# Altium schematic sheet S7CAS-PLEIADES-CARTE-MERE_P06_FPGA2.SCHDOC
size Tabloid; SheetNumber: 7; SheetTotal: 18; Sheet_Name: FPGA2; Size: 11x17
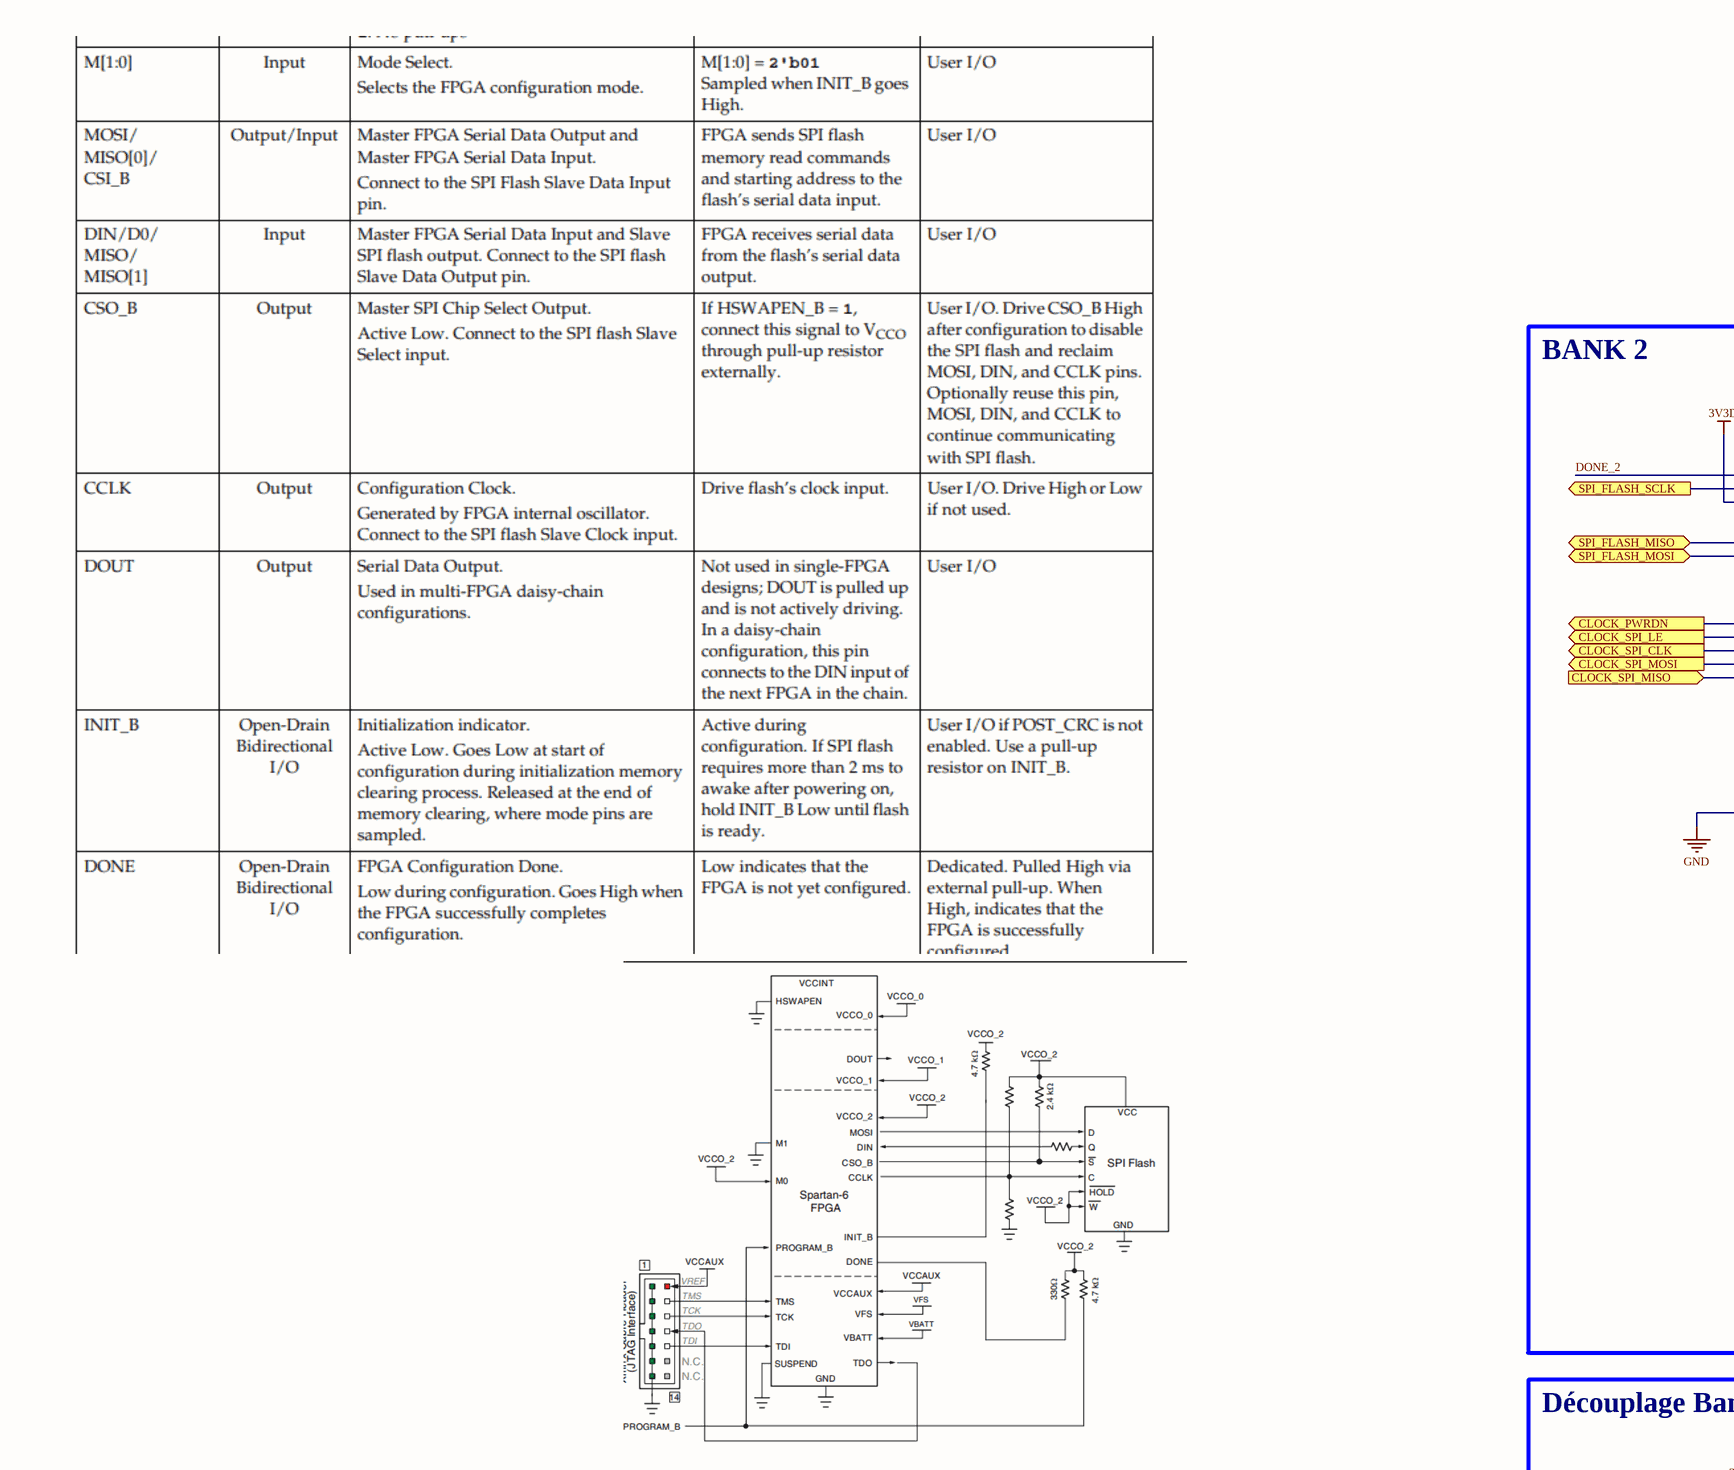
[diagram p0: S7CAS-PLEIADES-CARTE-MERE_P06_FPGA2.SCHDOC, top left]
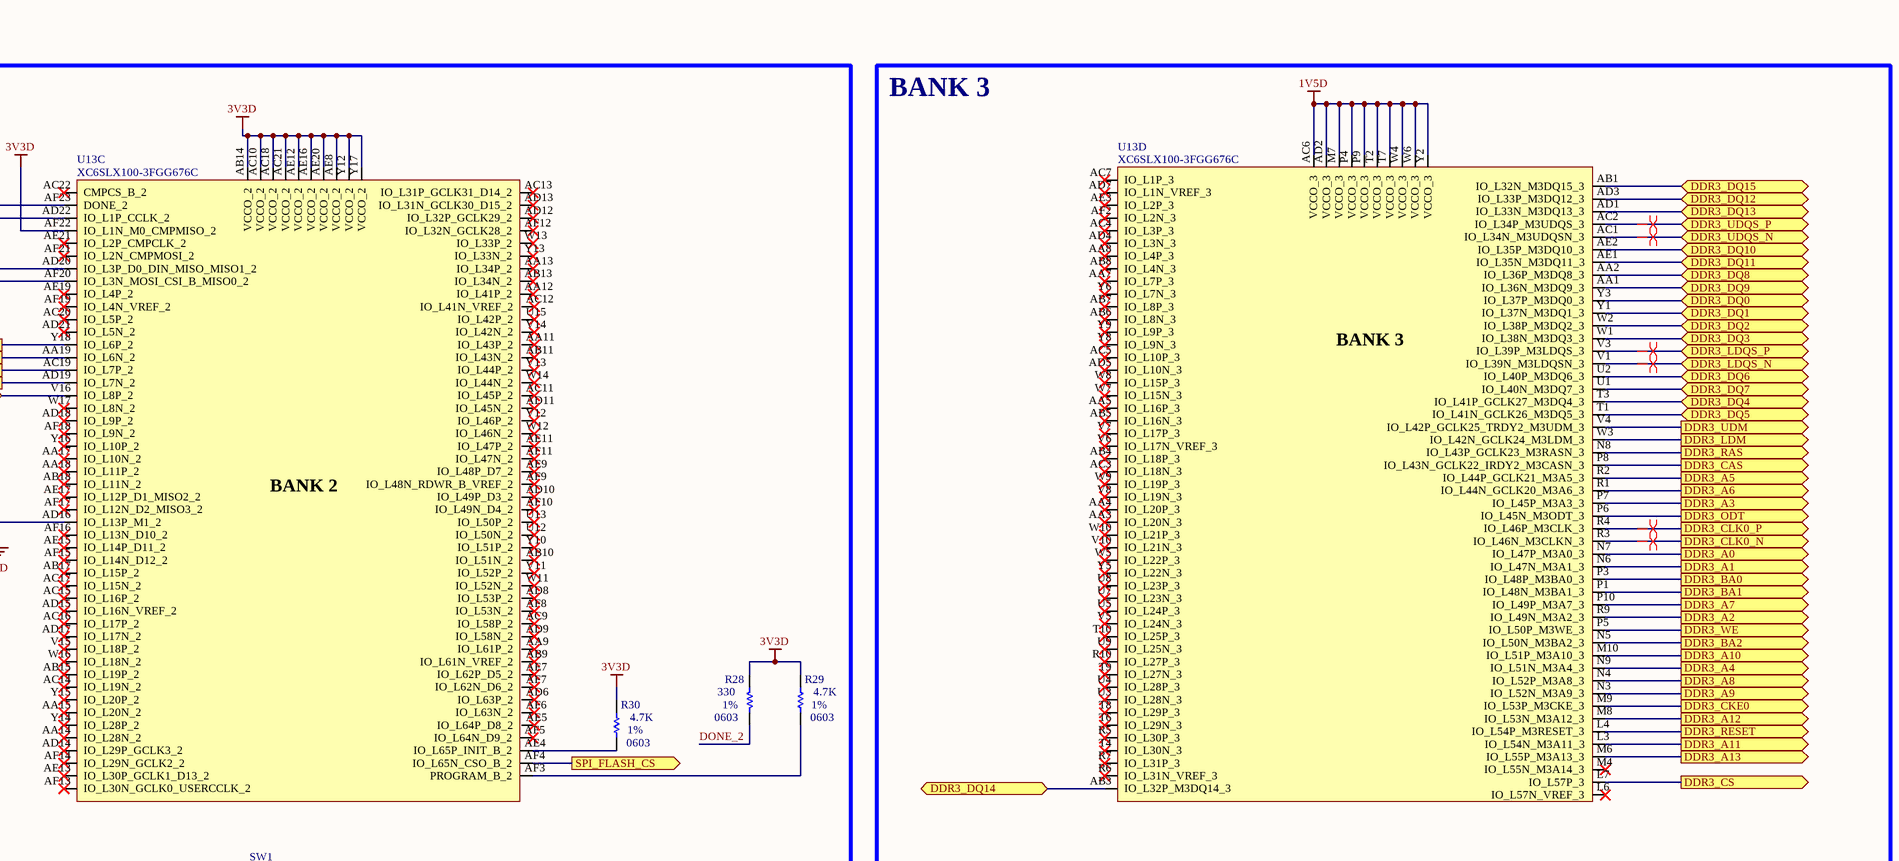
[diagram p1: S7CAS-PLEIADES-CARTE-MERE_P06_FPGA2.SCHDOC, top right]
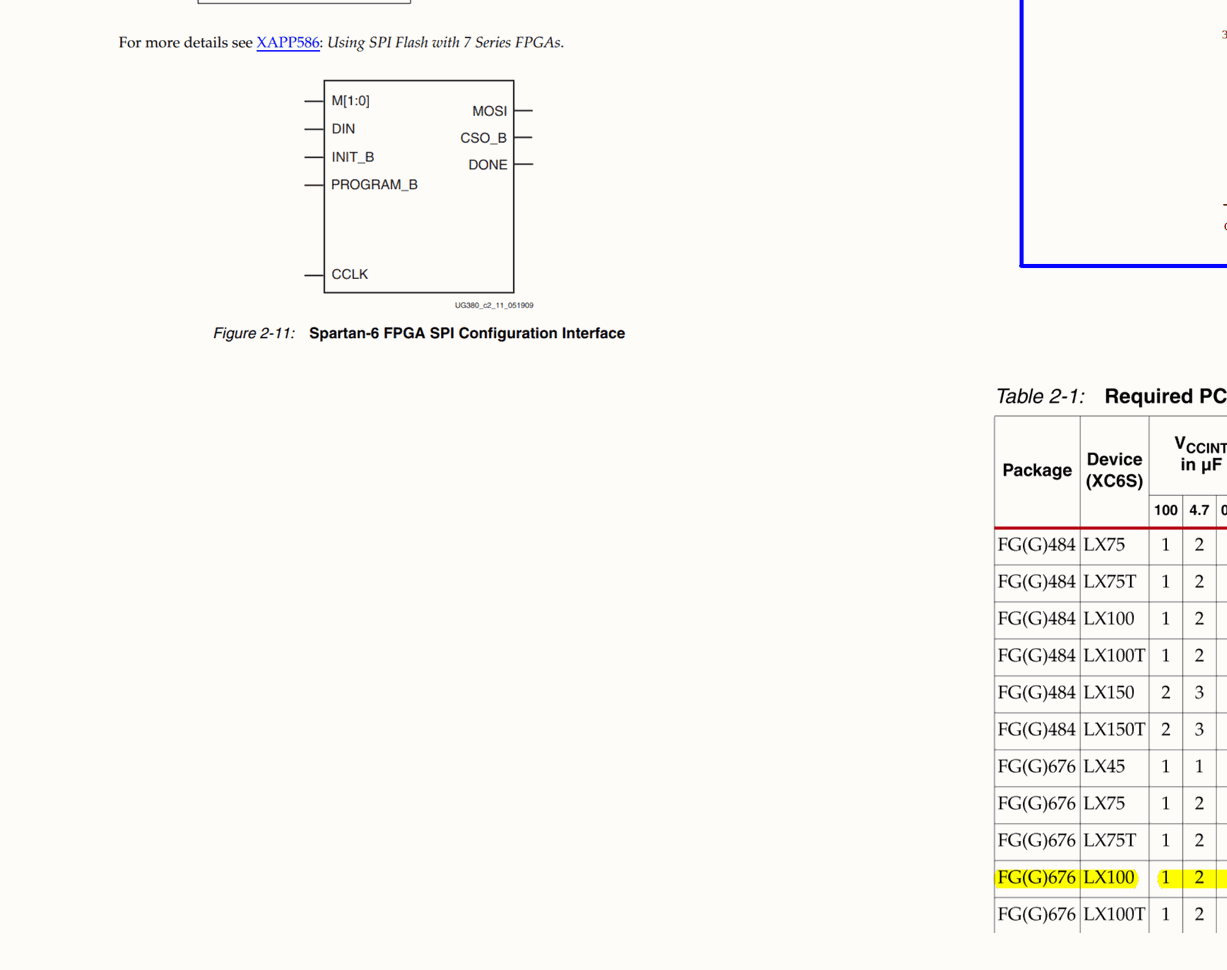
[diagram p2: S7CAS-PLEIADES-CARTE-MERE_P06_FPGA2.SCHDOC, bottom left]
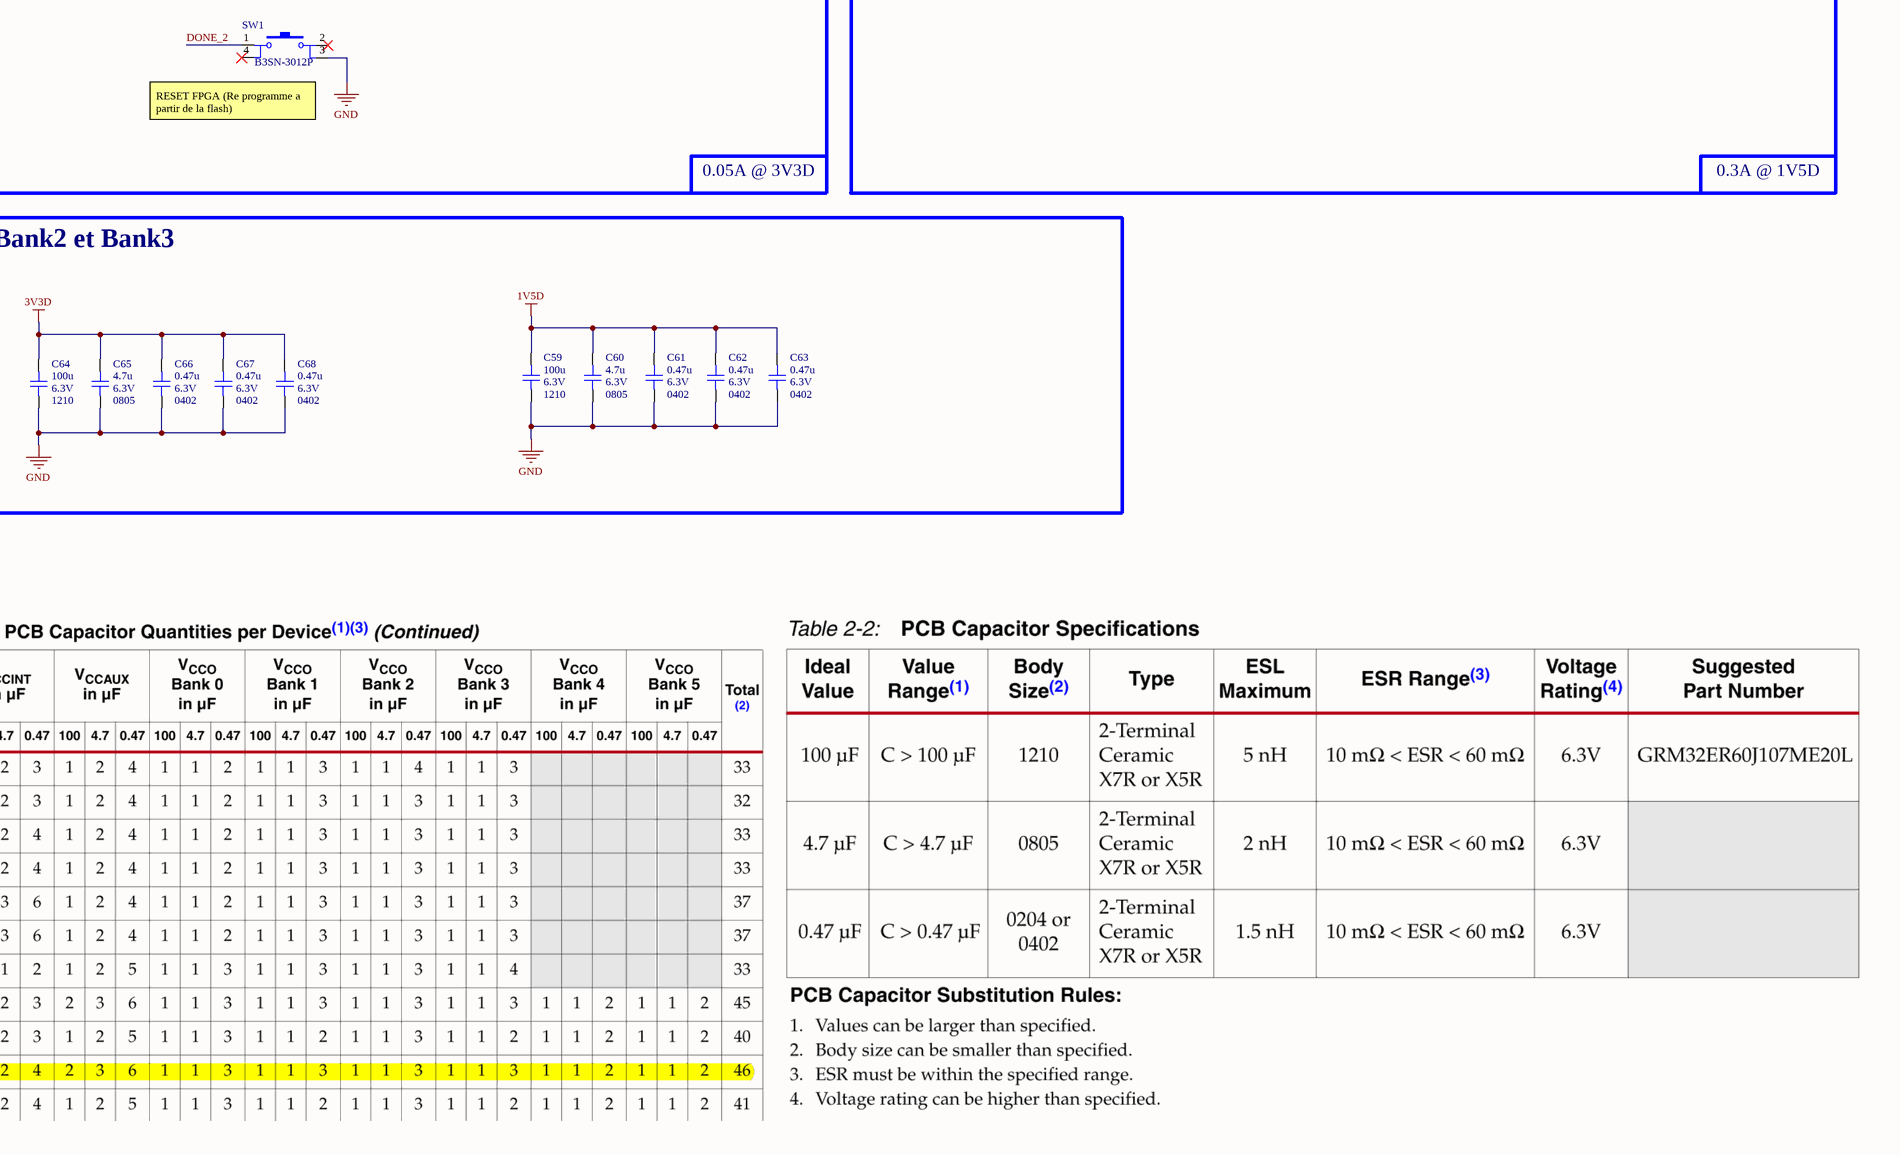
[diagram p3: S7CAS-PLEIADES-CARTE-MERE_P06_FPGA2.SCHDOC, bottom right]

## Parts
C59  value 100u  Voltage: 6.3V  Package: 1210  [CAP_1210]  (hidden comment: CAP - 1210)
C60  value 4.7u  Voltage: 6.3V  Package: 0805  [CAP_0805]  (hidden comment: CAP - 0805)
C61  value 0.47u  Voltage: 6.3V  Package: 0402  [CAP_0402]  (hidden comment: CAP - 0402)
C62  value 0.47u  Voltage: 6.3V  Package: 0402  [CAP_0402]  (hidden comment: CAP - 0402)
C63  value 0.47u  Voltage: 6.3V  Package: 0402  [CAP_0402]  (hidden comment: CAP - 0402)
C64  value 100u  Voltage: 6.3V  Package: 1210  [CAP_1210]  (hidden comment: CAP - 1210)
C65  value 4.7u  Voltage: 6.3V  Package: 0805  [CAP_0805]  (hidden comment: CAP - 0805)
C66  value 0.47u  Voltage: 6.3V  Package: 0402  [CAP_0402]  (hidden comment: CAP - 0402)
C67  value 0.47u  Voltage: 6.3V  Package: 0402  [CAP_0402]  (hidden comment: CAP - 0402)
C68  value 0.47u  Voltage: 6.3V  Package: 0402  [CAP_0402]  (hidden comment: CAP - 0402)
R28  value 330  Package: 0603  Precision: 1%  [RES_0603]  (hidden comment: RES - 0603)
R29  value 4.7K  Package: 0603  Precision: 1%  [RES_0603]  (hidden comment: RES - 0603)
R30  value 4.7K  Package: 0603  Precision: 1%  [RES_0603]  (hidden comment: RES - 0603)
SW1  B3SN-3012P  [SWI_TACT_B3SN-3012P]
U13  XC6SLX100-3FGG676C  [FPGA_XILINX_FGG676]  (parts C,D of 10)

## Blocks framed on the sheet
BANK 2: R28-R30 SW1 U13
BANK 3: U13
Découplage Bank2 et Bank3: C59-C68

## Ports
CLOCK_PWRDN (out, see S7CAS-PLEIADES-CARTE-MERE_P06_CLOCK[4B]), CLOCK_SPI_CLK (out, see S7CAS-PLEIADES-CARTE-MERE_P06_CLOCK[5B]), CLOCK_SPI_LE (out, see S7CAS-PLEIADES-CARTE-MERE_P06_CLOCK[5B]), CLOCK_SPI_MISO (in, see S7CAS-PLEIADES-CARTE-MERE_P06_CLOCK[5B]), CLOCK_SPI_MOSI (out, see S7CAS-PLEIADES-CARTE-MERE_P06_CLOCK[5B]), DDR3_A0 (out, see S7CAS-PLEIADES-CARTE-MERE_P06_DDR3[1B]), DDR3_A1 (out, see S7CAS-PLEIADES-CARTE-MERE_P06_DDR3[1B]), DDR3_A2 (out, see S7CAS-PLEIADES-CARTE-MERE_P06_DDR3[1B]), DDR3_A3 (out, see S7CAS-PLEIADES-CARTE-MERE_P06_DDR3[1B]), DDR3_A4 (out, see S7CAS-PLEIADES-CARTE-MERE_P06_DDR3[1B]), DDR3_A5 (out, see S7CAS-PLEIADES-CARTE-MERE_P06_DDR3[1B]), DDR3_A6 (out, see S7CAS-PLEIADES-CARTE-MERE_P06_DDR3[1B]), DDR3_A7 (out, see S7CAS-PLEIADES-CARTE-MERE_P06_DDR3[1B]), DDR3_A8 (out, see S7CAS-PLEIADES-CARTE-MERE_P06_DDR3[1B]), DDR3_A9 (out, see S7CAS-PLEIADES-CARTE-MERE_P06_DDR3[1B]), DDR3_A10 (out, see S7CAS-PLEIADES-CARTE-MERE_P06_DDR3[1B]), DDR3_A11 (out, see S7CAS-PLEIADES-CARTE-MERE_P06_DDR3[1B]), DDR3_A12 (out, see S7CAS-PLEIADES-CARTE-MERE_P06_DDR3[1B]), DDR3_A13 (out, see S7CAS-PLEIADES-CARTE-MERE_P06_DDR3[1B]), DDR3_BA0 (out, see S7CAS-PLEIADES-CARTE-MERE_P06_DDR3[1B]), DDR3_BA1 (out, see S7CAS-PLEIADES-CARTE-MERE_P06_DDR3[1B]), DDR3_BA2 (out, see S7CAS-PLEIADES-CARTE-MERE_P06_DDR3[1B]), DDR3_CAS (out, see S7CAS-PLEIADES-CARTE-MERE_P06_DDR3[1C]), DDR3_CKE0 (out, see S7CAS-PLEIADES-CARTE-MERE_P06_DDR3[1B]), DDR3_CLK0_N (out, see S7CAS-PLEIADES-CARTE-MERE_P06_DDR3[1B]), DDR3_CLK0_P (out, see S7CAS-PLEIADES-CARTE-MERE_P06_DDR3[1B]), DDR3_CS (out, see S7CAS-PLEIADES-CARTE-MERE_P06_DDR3[1C]), DDR3_DQ0 (bidir, see S7CAS-PLEIADES-CARTE-MERE_P06_DDR3[6B]), DDR3_DQ1 (bidir, see S7CAS-PLEIADES-CARTE-MERE_P06_DDR3[6B]), DDR3_DQ2 (bidir, see S7CAS-PLEIADES-CARTE-MERE_P06_DDR3[6B]), DDR3_DQ3 (bidir, see S7CAS-PLEIADES-CARTE-MERE_P06_DDR3[6B]), DDR3_DQ4 (bidir, see S7CAS-PLEIADES-CARTE-MERE_P06_DDR3[6B]), DDR3_DQ5 (bidir, see S7CAS-PLEIADES-CARTE-MERE_P06_DDR3[6B]), DDR3_DQ6 (bidir, see S7CAS-PLEIADES-CARTE-MERE_P06_DDR3[6B]), DDR3_DQ7 (bidir, see S7CAS-PLEIADES-CARTE-MERE_P06_DDR3[6B]), DDR3_DQ8 (bidir, see S7CAS-PLEIADES-CARTE-MERE_P06_DDR3[6B]), DDR3_DQ9 (bidir, see S7CAS-PLEIADES-CARTE-MERE_P06_DDR3[6B]), DDR3_DQ10 (bidir, see S7CAS-PLEIADES-CARTE-MERE_P06_DDR3[6B]), DDR3_DQ11 (bidir, see S7CAS-PLEIADES-CARTE-MERE_P06_DDR3[6B]), DDR3_DQ12 (bidir, see S7CAS-PLEIADES-CARTE-MERE_P06_DDR3[6B]), DDR3_DQ13 (bidir, see S7CAS-PLEIADES-CARTE-MERE_P06_DDR3[6B]), DDR3_DQ14 (bidir, see S7CAS-PLEIADES-CARTE-MERE_P06_DDR3[6B]), DDR3_DQ15 (bidir, see S7CAS-PLEIADES-CARTE-MERE_P06_DDR3[6B]), DDR3_LDM (out, see S7CAS-PLEIADES-CARTE-MERE_P06_DDR3[6B]), DDR3_LDQS_N (bidir, see S7CAS-PLEIADES-CARTE-MERE_P06_DDR3[6B]), DDR3_LDQS_P (bidir, see S7CAS-PLEIADES-CARTE-MERE_P06_DDR3[6B]), DDR3_ODT (out, see S7CAS-PLEIADES-CARTE-MERE_P06_DDR3[1C]), DDR3_RAS (out, see S7CAS-PLEIADES-CARTE-MERE_P06_DDR3[1C]), DDR3_RESET (out, see S7CAS-PLEIADES-CARTE-MERE_P06_DDR3[4A]), DDR3_UDM (out, see S7CAS-PLEIADES-CARTE-MERE_P06_DDR3[6B]), DDR3_UDQS_N (bidir, see S7CAS-PLEIADES-CARTE-MERE_P06_DDR3[6B]), DDR3_UDQS_P (bidir, see S7CAS-PLEIADES-CARTE-MERE_P06_DDR3[6B]), DDR3_WE (out, see S7CAS-PLEIADES-CARTE-MERE_P06_DDR3[1C]), SPI_FLASH_CS (out, see S7CAS-PLEIADES-CARTE-MERE_P06_FLASH[2A]), SPI_FLASH_MISO (bidir, see S7CAS-PLEIADES-CARTE-MERE_P06_FLASH[4A]), SPI_FLASH_MOSI (bidir, see S7CAS-PLEIADES-CARTE-MERE_P06_FLASH[4B]), SPI_FLASH_SCLK (out, see S7CAS-PLEIADES-CARTE-MERE_P06_FLASH[2A])

## Nets
1V5D: C59.2 C60.2 C61.2 C62.2 C63.2 U13.AC6(VCCO_3) U13.AD2(VCCO_3) U13.M7(VCCO_3) U13.P4(VCCO_3) U13.P9(VCCO_3) U13.T2(VCCO_3) U13.T7(VCCO_3) U13.W4(VCCO_3) U13.W6(VCCO_3) U13.Y2(VCCO_3)
3V3D: C64.2 C65.2 C66.2 C67.2 C68.2 R28.2 R29.2 R30.2 U13.AB14(VCCO_2) U13.AC10(VCCO_2) U13.AC18(VCCO_2) U13.AC21(VCCO_2) U13.AE8(VCCO_2) U13.AE12(VCCO_2) U13.AE16(VCCO_2) U13.AE20(VCCO_2) U13.AF22(IO_L1N_M0_CMPMISO_2) U13.Y12(VCCO_2) U13.Y17(VCCO_2)
GND: C59.1 C60.1 C61.1 C62.1 C63.1 C64.1 C65.1 C66.1 C67.1 C68.1 SW1.3 U13.AD16(IO_L13P_M1_2)
CLOCK_PWRDN: U13.Y18(IO_L6P_2) ; port CLOCK_PWRDN
CLOCK_SPI_CLK: U13.AC19(IO_L7P_2) ; port CLOCK_SPI_CLK
CLOCK_SPI_LE: U13.AA19(IO_L6N_2) ; port CLOCK_SPI_LE
CLOCK_SPI_MISO: U13.V16(IO_L8P_2) ; port CLOCK_SPI_MISO
CLOCK_SPI_MOSI: U13.AD19(IO_L7N_2) ; port CLOCK_SPI_MOSI
DDR3_A0: U13.N7(IO_L47P_M3A0_3) ; port DDR3_A0
DDR3_A1: U13.N6(IO_L47N_M3A1_3) ; port DDR3_A1
DDR3_A2: U13.R9(IO_L49N_M3A2_3) ; port DDR3_A2
DDR3_A3: U13.P7(IO_L45P_M3A3_3) ; port DDR3_A3
DDR3_A4: U13.N9(IO_L51N_M3A4_3) ; port DDR3_A4
DDR3_A5: U13.R2(IO_L44P_GCLK21_M3A5_3) ; port DDR3_A5
DDR3_A6: U13.R1(IO_L44N_GCLK20_M3A6_3) ; port DDR3_A6
DDR3_A7: U13.P10(IO_L49P_M3A7_3) ; port DDR3_A7
DDR3_A8: U13.N4(IO_L52P_M3A8_3) ; port DDR3_A8
DDR3_A9: U13.N3(IO_L52N_M3A9_3) ; port DDR3_A9
DDR3_A10: U13.M10(IO_L51P_M3A10_3) ; port DDR3_A10
DDR3_A11: U13.L3(IO_L54N_M3A11_3) ; port DDR3_A11
DDR3_A12: U13.M8(IO_L53N_M3A12_3) ; port DDR3_A12
DDR3_A13: U13.M6(IO_L55P_M3A13_3) ; port DDR3_A13
DDR3_BA0: U13.P3(IO_L48P_M3BA0_3) ; port DDR3_BA0
DDR3_BA1: U13.P1(IO_L48N_M3BA1_3) ; port DDR3_BA1
DDR3_BA2: U13.N5(IO_L50N_M3BA2_3) ; port DDR3_BA2
DDR3_CAS: U13.P8(IO_L43N_GCLK22_IRDY2_M3CASN_3) ; port DDR3_CAS
DDR3_CKE0: U13.M9(IO_L53P_M3CKE_3) ; port DDR3_CKE0
DDR3_CLK0_N: U13.R3(IO_L46N_M3CLKN_3) ; port DDR3_CLK0_N
DDR3_CLK0_P: U13.R4(IO_L46P_M3CLK_3) ; port DDR3_CLK0_P
DDR3_CS: U13.L7(IO_L57P_3) ; port DDR3_CS
DDR3_DQ0: U13.Y3(IO_L37P_M3DQ0_3) ; port DDR3_DQ0
DDR3_DQ1: U13.Y1(IO_L37N_M3DQ1_3) ; port DDR3_DQ1
DDR3_DQ2: U13.W2(IO_L38P_M3DQ2_3) ; port DDR3_DQ2
DDR3_DQ3: U13.W1(IO_L38N_M3DQ3_3) ; port DDR3_DQ3
DDR3_DQ4: U13.T3(IO_L41P_GCLK27_M3DQ4_3) ; port DDR3_DQ4
DDR3_DQ5: U13.T1(IO_L41N_GCLK26_M3DQ5_3) ; port DDR3_DQ5
DDR3_DQ6: U13.U2(IO_L40P_M3DQ6_3) ; port DDR3_DQ6
DDR3_DQ7: U13.U1(IO_L40N_M3DQ7_3) ; port DDR3_DQ7
DDR3_DQ8: U13.AA2(IO_L36P_M3DQ8_3) ; port DDR3_DQ8
DDR3_DQ9: U13.AA1(IO_L36N_M3DQ9_3) ; port DDR3_DQ9
DDR3_DQ10: U13.AE2(IO_L35P_M3DQ10_3) ; port DDR3_DQ10
DDR3_DQ11: U13.AE1(IO_L35N_M3DQ11_3) ; port DDR3_DQ11
DDR3_DQ12: U13.AD3(IO_L33P_M3DQ12_3) ; port DDR3_DQ12
DDR3_DQ13: U13.AD1(IO_L33N_M3DQ13_3) ; port DDR3_DQ13
DDR3_DQ14: U13.AB3(IO_L32P_M3DQ14_3) ; port DDR3_DQ14
DDR3_DQ15: U13.AB1(IO_L32N_M3DQ15_3) ; port DDR3_DQ15
DDR3_LDM: U13.W3(IO_L42N_GCLK24_M3LDM_3) ; port DDR3_LDM
DDR3_LDQS_N: U13.V1(IO_L39N_M3LDQSN_3) ; port DDR3_LDQS_N
DDR3_LDQS_P: U13.V3(IO_L39P_M3LDQS_3) ; port DDR3_LDQS_P
DDR3_ODT: U13.P6(IO_L45N_M3ODT_3) ; port DDR3_ODT
DDR3_RAS: U13.N8(IO_L43P_GCLK23_M3RASN_3) ; port DDR3_RAS
DDR3_RESET: U13.L4(IO_L54P_M3RESET_3) ; port DDR3_RESET
DDR3_UDM: U13.V4(IO_L42P_GCLK25_TRDY2_M3UDM_3) ; port DDR3_UDM
DDR3_UDQS_N: U13.AC1(IO_L34N_M3UDQSN_3) ; port DDR3_UDQS_N
DDR3_UDQS_P: U13.AC2(IO_L34P_M3UDQS_3) ; port DDR3_UDQS_P
DDR3_WE: U13.P5(IO_L50P_M3WE_3) ; port DDR3_WE
DONE_2: R28.1 SW1.1 U13.AF23(DONE_2)
SPI_FLASH_CS: U13.AF4(IO_L65N_CSO_B_2) ; port SPI_FLASH_CS
SPI_FLASH_MISO: U13.AD20(IO_L3P_D0_DIN_MISO_MISO1_2) ; port SPI_FLASH_MISO
SPI_FLASH_MOSI: U13.AF20(IO_L3N_MOSI_CSI_B_MISO0_2) ; port SPI_FLASH_MOSI
SPI_FLASH_SCLK: U13.AD22(IO_L1P_CCLK_2) ; port SPI_FLASH_SCLK
NetR29_1: R29.1 U13.AF3(PROGRAM_B_2)
NetR30_1: R30.1 U13.AE4(IO_L65P_INIT_B_2)

Not connected (* = marked no-connect by the designer): SW1 2* 4*; U13 AA3(IO_L20N_3)* AA4(IO_L20P_3)* AA5(IO_L16P_3)* AA7(IO_L7P_3)* AA8(IO_L4P_3)* AA9(IO_L61P_2)* AA11(IO_L43P_2)* AA12(IO_L41P_2)* AA13(IO_L34P_2)* AA14(IO_L28N_2)* AA15(IO_L20N_2)* AA17(IO_L10N_2)* AA18(IO_L11P_2)* AB4(IO_L18P_3)* AB5(IO_L16N_3)* AB6(IO_L8N_3)* AB7(IO_L8P_3)* AB8(IO_L4N_3)* AB9(IO_L61N_VREF_2)* AB10(IO_L51N_2)* AB11(IO_L43N_2)* AB13(IO_L34N_2)* AB15(IO_L19P_2)* AB17(IO_L15P_2)* AB18(IO_L11N_2)* AC3(IO_L18N_3)* AC4(IO_L3P_3)* AC5(IO_L10P_3)* AC7(IO_L1P_3)* AC9(IO_L58P_2)* AC11(IO_L45P_2)* AC12(IO_L41N_VREF_2)* AC13(IO_L31P_GCLK31_D14_2)* AC14(IO_L19N_2)* AC15(IO_L16P_2)* AC16(IO_L17P_2)* AC17(IO_L15N_2)* AC20(IO_L5P_2)* AC22(CMPCS_B_2)* AD4(IO_L3N_3)* AD5(IO_L10N_3)* AD6(IO_L63P_2)* AD7(IO_L1N_VREF_3)* AD8(IO_L53P_2)* AD9(IO_L58N_2)* AD10(IO_L49P_D3_2)* AD11(IO_L45N_2)* AD12(IO_L32P_GCLK29_2)* AD13(IO_L31N_GCLK30_D15_2)* AD14(IO_L29P_GCLK3_2)* AD15(IO_L16N_VREF_2)* AD17(IO_L17N_2)* AD18(IO_L9P_2)* AD21(IO_L5N_2)* AE3(IO_L2P_3)* AE5(IO_L64P_D8_2)* AE7(IO_L62P_D5_2)* AE9(IO_L48P_D7_2)* AE11(IO_L47P_2)* AE13(IO_L30P_GCLK1_D13_2)* AE15(IO_L14P_D11_2)* AE17(IO_L12P_D1_MISO2_2)* AE19(IO_L4P_2)* AE21(IO_L2P_CMPCLK_2)* AF2(IO_L2N_3)* AF5(IO_L64N_D9_2)* AF6(IO_L63N_2)* AF7(IO_L62N_D6_2)* AF8(IO_L53N_2)* AF9(IO_L48N_RDWR_B_VREF_2)* AF10(IO_L49N_D4_2)* AF11(IO_L47N_2)* AF12(IO_L32N_GCLK28_2)* AF13(IO_L30N_GCLK0_USERCCLK_2)* AF14(IO_L29N_GCLK2_2)* AF15(IO_L14N_D12_2)* AF16(IO_L13N_D10_2)* AF17(IO_L12N_D2_MISO3_2)* AF18(IO_L9N_2)* AF19(IO_L4N_VREF_2)* AF21(IO_L2N_CMPMOSI_2)* L6(IO_L57N_VREF_3)* M4(IO_L55N_M3A14_3)* R5(IO_L30P_3)* R6(IO_L31N_VREF_3)* R7(IO_L31P_3)* R10(IO_L27P_3)* T4(IO_L30N_3)* T6(IO_L29N_3)* T8(IO_L29P_3)* T9(IO_L27N_3)* T10(IO_L25P_3)* U3(IO_L28N_3)* U4(IO_L28P_3)* U5(IO_L24P_3)* U7(IO_L23N_3)* U8(IO_L23P_3)* U9(IO_L25N_3)* U12(IO_L50N_2)* U13(IO_L50P_2)* U15(IO_L42P_2)* V5(IO_L24N_3)* V6(IO_L17N_VREF_3)* V7(IO_L17P_3)* V8(IO_L19N_3)* V10(IO_L21N_3)* V11(IO_L52P_2)* V12(IO_L46P_2)* V13(IO_L44P_2)* V14(IO_L42N_2)* V15(IO_L18P_2)* W5(IO_L22P_3)* W7(IO_L15N_3)* W8(IO_L15P_3)* W9(IO_L19P_3)* W10(IO_L21P_3)* W11(IO_L52N_2)* W12(IO_L46N_2)* W13(IO_L33P_2)* W14(IO_L44N_2)* W16(IO_L18N_2)* W17(IO_L8N_2)* Y5(IO_L22N_3)* Y6(IO_L7N_3)* Y8(IO_L9N_3)* Y9(IO_L9P_3)* Y10(IO_L51P_2)* Y13(IO_L33N_2)* Y14(IO_L28P_2)* Y15(IO_L20P_2)* Y16(IO_L10P_2)*

## Layout directives
differential pair: DDR3_CLK0_N, DDR3_CLK0_P, DDR3_LDQS_N, DDR3_LDQS_P, DDR3_UDQS_N, DDR3_UDQS_P

## Notes on the sheet
- (near SW1) RESET FPGA (Re programme a partir de la flash)
- 0.05A @ 3V3D
- 0.3A @ 1V5D
- Sheet Name
- Project Title
- Global Project
- Size
- Group
- Revision
- Date
- Sheet
- of
- Filename
- Designers
- (in symbol FPGA_XC6SLX100-3FGG676C, part C) BANK 2
- (in symbol FPGA_XC6SLX100-3FGG676C, part D) BANK 3

## Library data of the parts
C59 C64 = CAP - 1210: Precision: 10%; Current: *; CreatedBy: Jonathan Bouchard; Power: *
C60 C65 = CAP - 0805: Precision: 10%; Current: *; CreatedBy: Jonathan Bouchard; Power: *
C61-C63 C66-C68 = CAP - 0402: Precision: 10%; Current: *; CreatedBy: Jonathan Bouchard; Power: *
SW1 = SWI_TACT_B3SN-3012P: SWI - TACT SPST-NO 0.05A 24V - 4-SMD; Current: 50mA; Mfg: Omron; Mfg Part Number: B3SN-3012P; HelpURL: http://www.omron.com/ecb/products/pdf/en-b3sn.pdf; CreatedBy: Jonathan Bouchard; Temperature: -25°C ~ 70°C; Power: *; Precision: *; Package: 4-SMD; Value: *; Voltage: 24V; Supplier 1: Digikey; Supplier Part Number 1: SW261CT-ND
U13 = FPGA_XC6SLX100-3FGG676C: FPGA - XILINX SPARTAN 6 480 I/O - BGA-676; Voltage: 1.14 V ~ 1.26 V; Current: *; Power: *; Mfg: Xilinx; Mfg Part Number: XC6SLX100-3FGG676C; HelpURL: https://www.xilinx.com/support/documentation/data_sheets/ds162.pdf; CreatedBy: Jonathan Bouchard; Temperature: 0°C ~ 85°C (TJ); Value: *; Precision: *; Package: BGA-676; Supplier 1: Digikey; Supplier Part Number 1: 122-1760-ND
R28-R30 = RES - 0603: Current: *; CreatedBy: Jonathan Bouchard